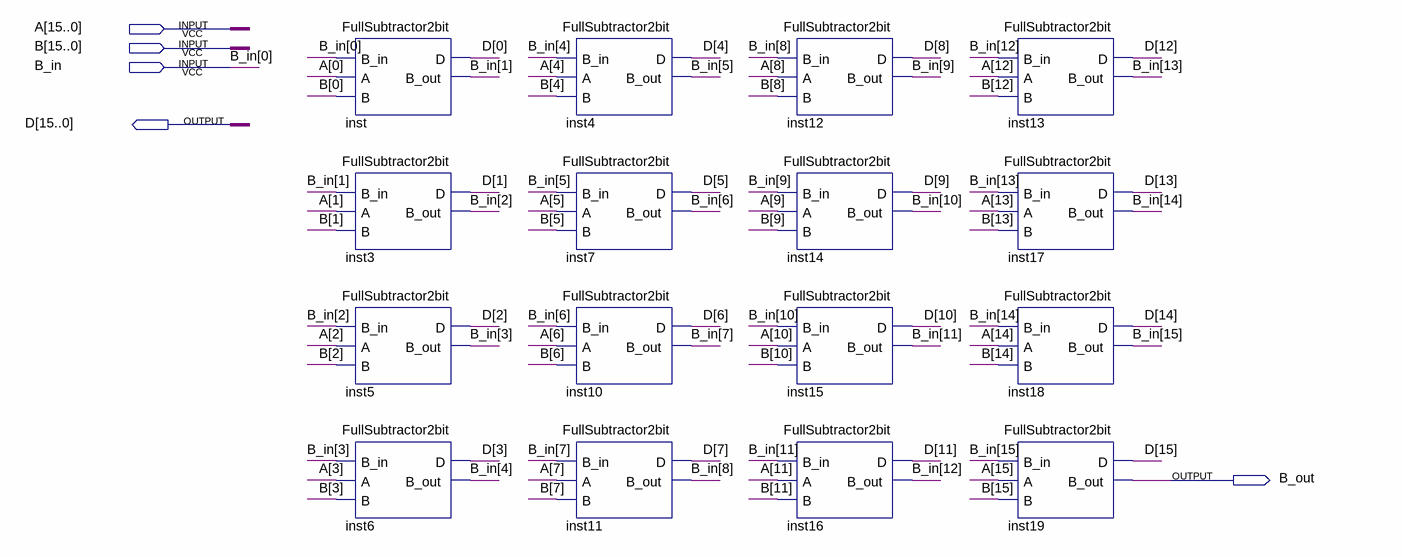
[diagram p0: schematic sheet]
// Quartus schematic FullSubtractor16bit.bdf as structural Verilog: 16 symbols, 5 pins
module FullSubtractor16bit (
  input  [15:0] A,
  input  [15:0] B,
  input  B_in,
  output [15:0] D,
  output B_out
);

  wire [15:1] B_in_bus;

  FullSubtractor2bit inst (.B_in(B_in), .A(A[0]), .B(B[0]), .D(D[0]), .B_out(B_in_bus[1]));
  FullSubtractor2bit inst3 (.B_in(B_in_bus[1]), .A(A[1]), .B(B[1]), .D(D[1]), .B_out(B_in_bus[2]));
  FullSubtractor2bit inst5 (.B_in(B_in_bus[2]), .A(A[2]), .B(B[2]), .D(D[2]), .B_out(B_in_bus[3]));
  FullSubtractor2bit inst6 (.B_in(B_in_bus[3]), .A(A[3]), .B(B[3]), .D(D[3]), .B_out(B_in_bus[4]));
  FullSubtractor2bit inst4 (.B_in(B_in_bus[4]), .A(A[4]), .B(B[4]), .D(D[4]), .B_out(B_in_bus[5]));
  FullSubtractor2bit inst7 (.B_in(B_in_bus[5]), .A(A[5]), .B(B[5]), .D(D[5]), .B_out(B_in_bus[6]));
  FullSubtractor2bit inst10 (.B_in(B_in_bus[6]), .A(A[6]), .B(B[6]), .D(D[6]), .B_out(B_in_bus[7]));
  FullSubtractor2bit inst11 (.B_in(B_in_bus[7]), .A(A[7]), .B(B[7]), .D(D[7]), .B_out(B_in_bus[8]));
  FullSubtractor2bit inst12 (.B_in(B_in_bus[8]), .A(A[8]), .B(B[8]), .D(D[8]), .B_out(B_in_bus[9]));
  FullSubtractor2bit inst14 (.B_in(B_in_bus[9]), .A(A[9]), .B(B[9]), .D(D[9]), .B_out(B_in_bus[10]));
  FullSubtractor2bit inst15 (.B_in(B_in_bus[10]), .A(A[10]), .B(B[10]), .D(D[10]), .B_out(B_in_bus[11]));
  FullSubtractor2bit inst16 (.B_in(B_in_bus[11]), .A(A[11]), .B(B[11]), .D(D[11]), .B_out(B_in_bus[12]));
  FullSubtractor2bit inst13 (.B_in(B_in_bus[12]), .A(A[12]), .B(B[12]), .D(D[12]), .B_out(B_in_bus[13]));
  FullSubtractor2bit inst17 (.B_in(B_in_bus[13]), .A(A[13]), .B(B[13]), .D(D[13]), .B_out(B_in_bus[14]));
  FullSubtractor2bit inst18 (.B_in(B_in_bus[14]), .A(A[14]), .B(B[14]), .D(D[14]), .B_out(B_in_bus[15]));
  FullSubtractor2bit inst19 (.B_in(B_in_bus[15]), .A(A[15]), .B(B[15]), .D(D[15]), .B_out(B_out));

  // Other names for the same wires on the sheet: B_in[0] = B_in
endmodule
